# Altium schematic sheet FrontPanel.SchDoc
size A4; Organization: Altium Limited; Address1: L3, 12a Rodborough Rd; Address2: Frenchs Forest; Address3: NSW; Address4: Australia 2086
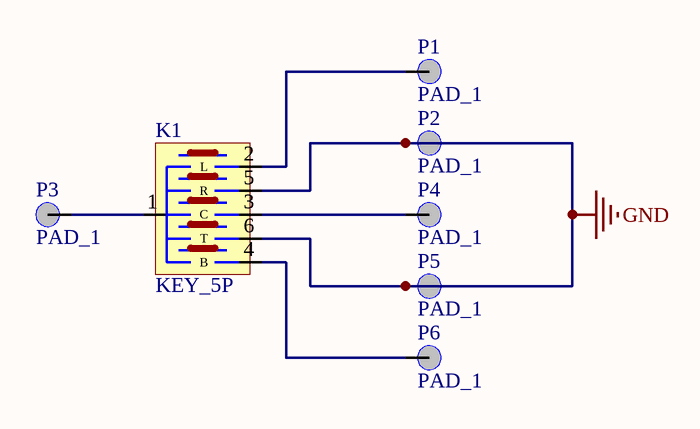
[diagram p0: FrontPanel.SchDoc]

## Parts
K1  KEY_5P  [KEY_5]
P1  PAD_1  [Pad_Slot_1]
P2  PAD_1  [Pad_Pin_1]
P3  PAD_1  [Pad_Slot_1]
P4  PAD_1  [Pad_Slot_1]
P5  PAD_1  [Pad_Pin_1]
P6  PAD_1  [Pad_Slot_1]

## Nets
GND: K1.5(R) K1.6(T) P2.1 P5.1
NetK1_1: K1.1(G) P3.1
NetK1_2: K1.2(L) P1.1
NetK1_3: K1.3(C) P4.1
NetK1_4: K1.4(B) P6.1

## Notes on the sheet
- Title
- Size:
- Date:
- A4
- Number:
- Time:
- Revision:
- Sheet
- of
- File:

## Library data of the parts
K1 = KEY_5P: 五向开关
P1-P6 = PAD_1: 1脚焊盘